# Altium project HYDRA_V3_POWER.PrjPcb (part 2 of 2)

## Sheet STM32G473CET6_PINOUT.SchDoc
size C; SheetNumber: 8; SheetTotal: 11
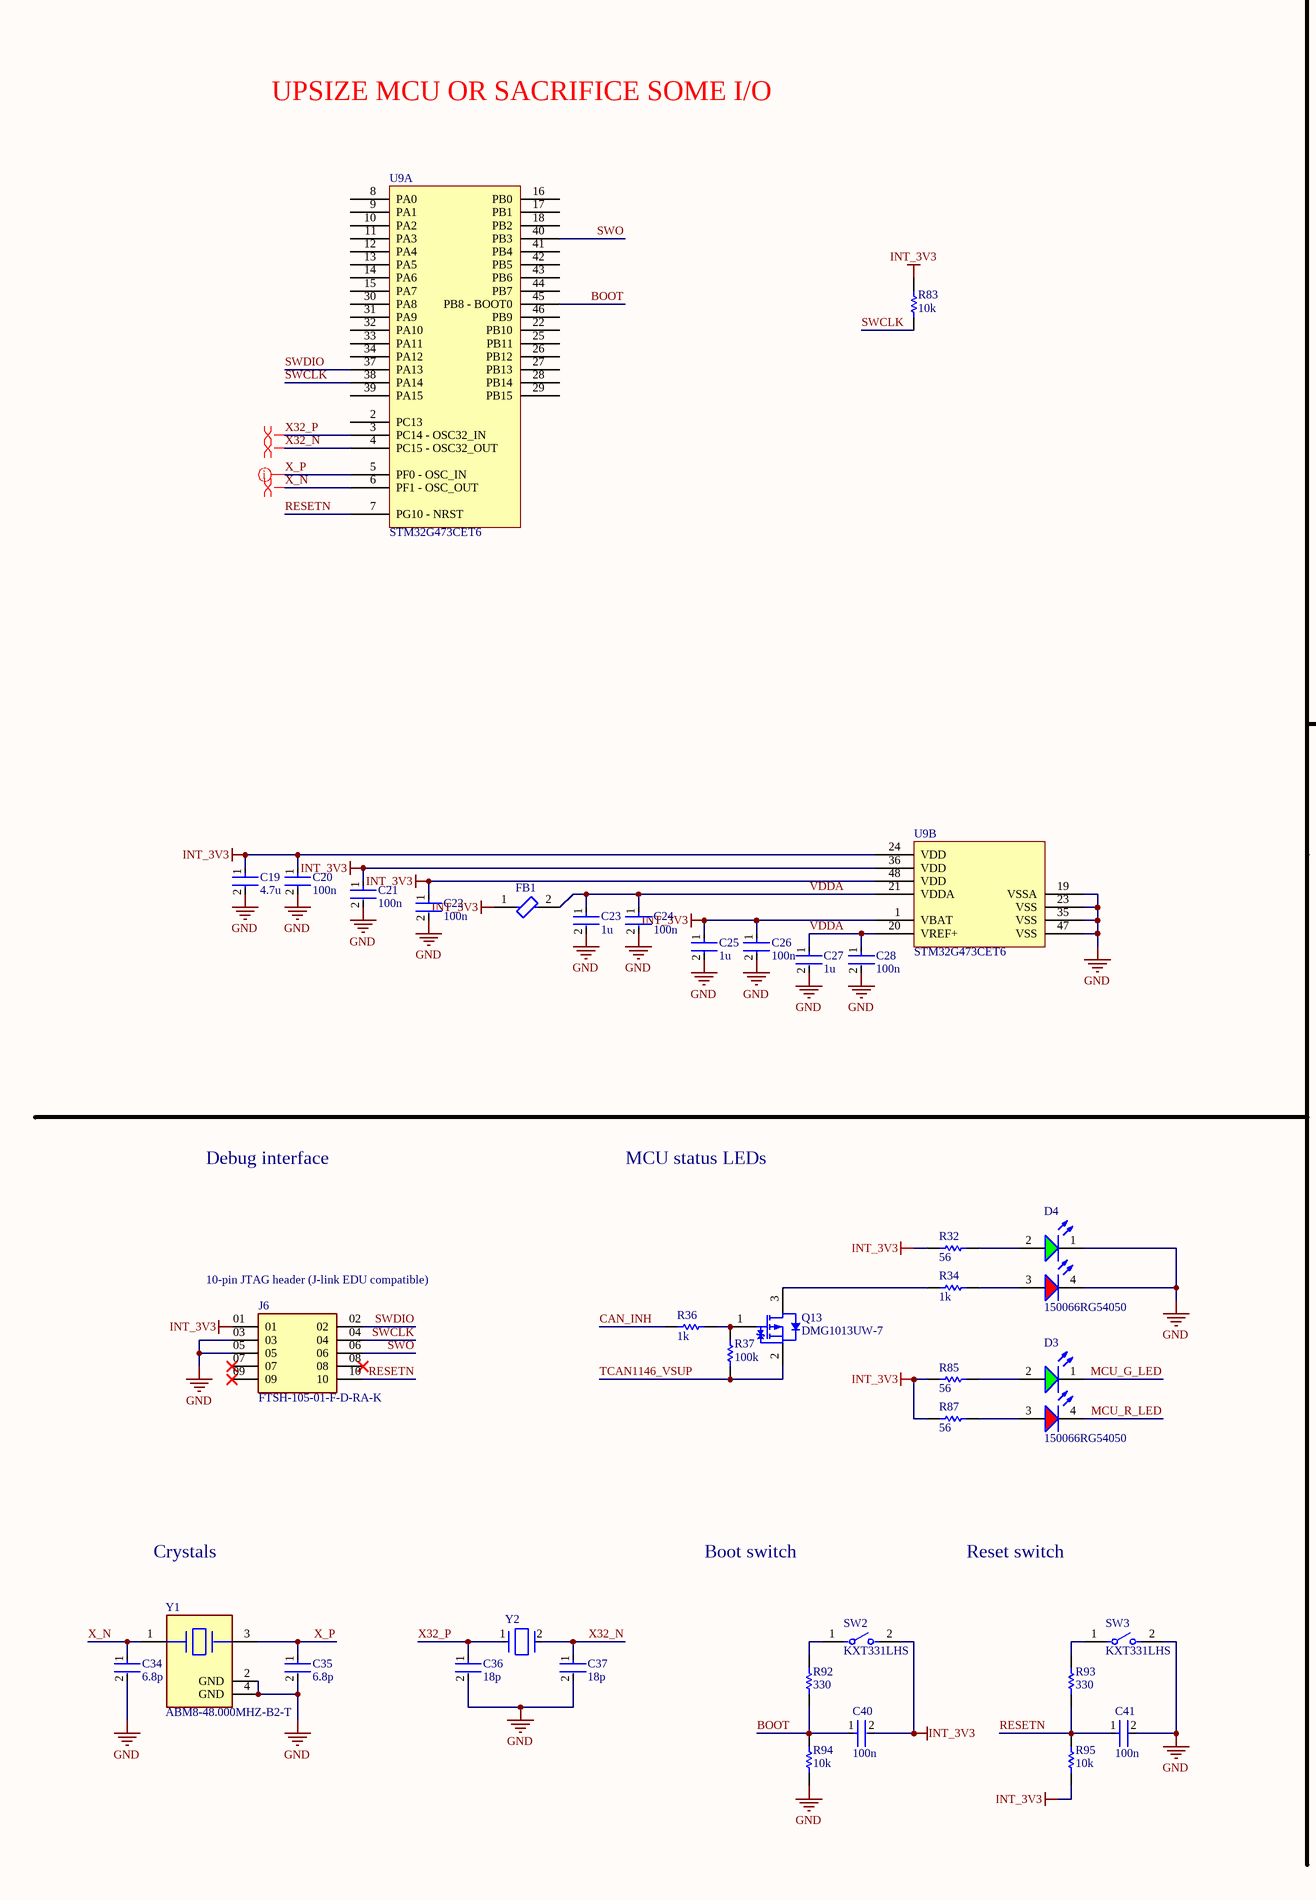
[diagram p12: STM32G473CET6_PINOUT.SchDoc, left]
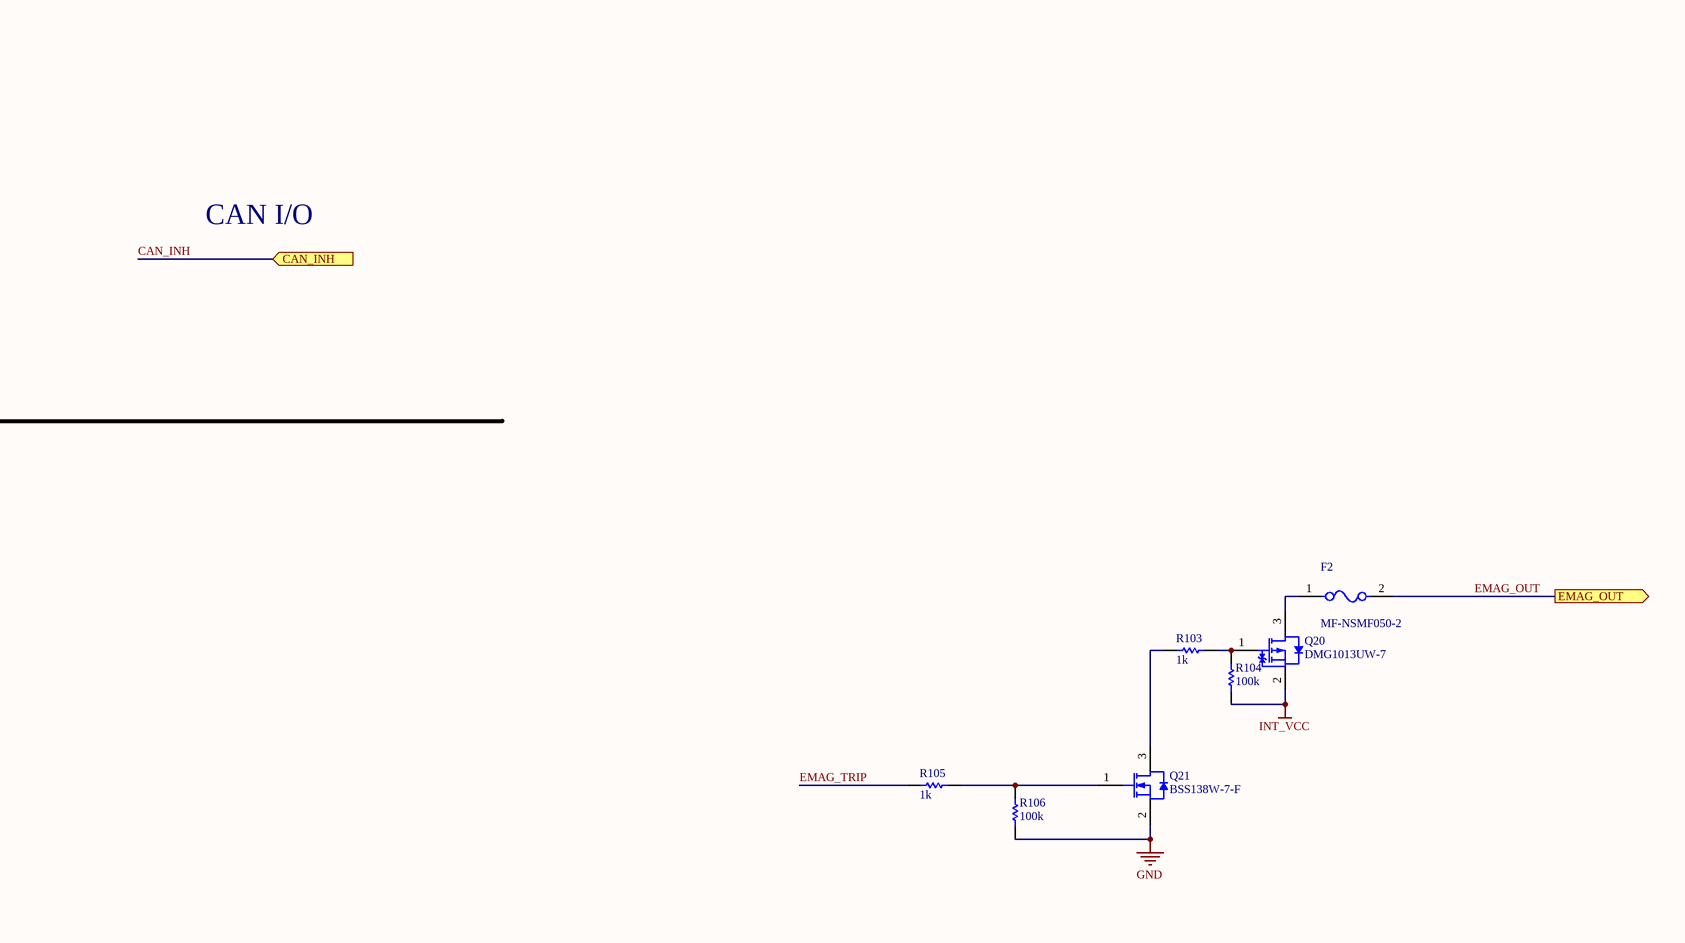
[diagram p13: STM32G473CET6_PINOUT.SchDoc, right]

### Parts
(Parts that share a designator on the sheet are numbered #1, #2 ... from top to bottom, then left to right.)
C19  4.7u  [FP-0402-L_1_0_0_05-W_0_5-IPC_A]
C20  100n  [FP-0402-L_1_0_0_05-W_0_5-IPC_A]
C21  100n  [FP-0402-L_1_0_0_05-W_0_5-IPC_A]
C22  100n  [FP-0402-L_1_0_0_05-W_0_5-IPC_A]
C23  1u  [FP-0402-L_1_0_0_05-W_0_5-IPC_A]
C24  100n  [FP-0402-L_1_0_0_05-W_0_5-IPC_A]
C25  1u  [FP-0402-L_1_0_0_05-W_0_5-IPC_A]
C26  100n  [FP-0402-L_1_0_0_05-W_0_5-IPC_A]
C27  1u  [FP-0402-L_1_0_0_05-W_0_5-IPC_A]
C28  100n  [FP-0402-L_1_0_0_05-W_0_5-IPC_A]
C34  6.8p  [FP-0402-L_1_0_0_05-W_0_5-IPC_A]
C35  6.8p  [FP-0402-L_1_0_0_05-W_0_5-IPC_A]
C36  18p  [FP-0402-L_1_0_0_05-W_0_5-IPC_A]
C37  18p  [FP-0402-L_1_0_0_05-W_0_5-IPC_A]
C40  100n  [FP-0402-L_1_0_0_05-W_0_5-IPC_A]
C41  100n  [FP-0402-L_1_0_0_05-W_0_5-IPC_A]
D3  150066RG54050  [WL-SBCD_0606]
D4  150066RG54050  [WL-SBCD_0606]
F2#2  MF-NSMF050-2  [FP-MF-NSMF050-2-MFG]
FB1  BLM15PX601SN1D  [FP-BLM15-0_05-MFG]  (value not drawn)
J6  FTSH-105-01-F-D-RA-K  [FTSH-105-01-F-D-RA-K-Footprint-1]
Q13  DMG1013UW-7  [DIOD-SOT323-3_V]
Q20  DMG1013UW-7  [DIOD-SOT323-3_V]
Q21  BSS138W-7-F  [DIOD-SOT323-3_V]
R32  56  [R0603B]
R34  1k  [R0603B]
R36  1k  [R0603B]
R37  100k  [R0603B]
R83  10k  [R0603B]
R85  56  [R0603B]
R87  56  [R0603B]
R92  330  [R0603B]
R93  330  [R0603B]
R94  10k  [R0603B]
R95  10k  [R0603B]
R103  1k  [R0603B]
R104  100k  [R0603B]
R105  1k  [R0603B]
R106  100k  [R0603B]
SW2  KXT331LHS  [FP-KXT331LHS-MFG]
SW3  KXT331LHS  [FP-KXT331LHS-MFG]
U9  STM32G473CET6  [TSQFP50P900X900X160-48N]  (parts A,B of 2)
Y1  ABM8-48.000MHZ-B2-T  [FP-ABM8-MFG]
Y2  ECS-.327-12.5-1210-TR  [FP-ECX-1210-MFG]  (value not drawn)

### Ports
CAN_INH (in), EMAG_OUT (out)

### Nets
GND: C19.2 C20.2 C21.2 C22.2 C23.2 C24.2 C25.2 C26.2 C27.2 C28.2 C34.2 C35.2 C36.2 C37.2 C41.2 D4.1(K) D4.4(K) J6.03 J6.05 Q21.2(S) R94.1 R106.1 SW3.2 U9.19(VSSA) U9.23(VSS) U9.35(VSS) U9.47(VSS) Y1.2(GND) Y1.4(GND)
INT_3V3: C19.1 C20.1 C21.1 C22.1 C25.1 C26.1 C40.2 FB1.1 J6.01 R32.2 R83.2 R85.2 R87.2 R95.1 SW2.2 U9.1(VBAT) U9.24(VDD) U9.36(VDD) U9.48(VDD)
INT_VCC: Q20.2(S) R104.2  [project net INT_PWR]
BOOT: C40.1 R92.1 R94.2 U9.45(PB8_-_BOOT0)
CAN_INH: R36.2 ; port CAN_INH
EMAG_OUT: F2#2.2 ; port EMAG_OUT
EMAG_TRIP: R105.2
MCU_G_LED: D3.1(K)
MCU_R_LED: D3.4(K)
RESETN: C41.1 J6.10 R93.1 R95.2 U9.7(PG10_-_NRST)
SWCLK: J6.04 R83.1 U9.38(PA14)
SWDIO: J6.02 U9.37(PA13)
SWO: J6.06 U9.40(PB3)
TCAN1146_VSUP: Q13.2(S) R37.2
VDDA: C23.1 C24.1 C27.1 C28.1 FB1.2 U9.20(VREF+) U9.21(VDDA)
X32_N: C37.1 U9.4(PC15_-_OSC32_OUT) Y2.2(Out/In)
X32_P: C36.1 U9.3(PC14_-_OSC32_IN) Y2.1(In/Out)
X_N: C34.1 U9.6(PF1_-_OSC_OUT) Y1.1
X_P: C35.1 U9.5(PF0_-_OSC_IN) Y1.3
NetD3_2: D3.2(A) R85.1
NetD3_3: D3.3(A) R87.1
NetD4_2: D4.2(A) R32.1
NetD4_3: D4.3(A) R34.1
NetF2#2_1: F2#2.1 Q20.3(D)
NetQ13_1: Q13.1(G) R36.1 R37.1
NetQ13_3: Q13.3(D) R34.2
NetQ20_1: Q20.1(G) R103.1 R104.1
NetQ21_1: Q21.1(G) R105.1 R106.2
NetQ21_3: Q21.3(D) R103.2
NetR92_2: R92.2 SW2.1
NetR93_2: R93.2 SW3.1

Not connected (* = marked no-connect by the designer): J6 07* 08* 09*; U9 2(PC13) 8(PA0) 9(PA1) 10(PA2) 11(PA3) 12(PA4) 13(PA5) 14(PA6) 15(PA7) 16(PB0) 17(PB1) 18(PB2) 22(PB10) 25(PB11) 26(PB12) 27(PB13) 28(PB14) 29(PB15) 30(PA8) 31(PA9) 32(PA10) 33(PA11) 34(PA12) 39(PA15) 41(PB4) 42(PB5) 43(PB6) 44(PB7) 46(PB9)

### Layout directives
differential pair: X32_N, X32_P, X_N, X_P

### Notes on the sheet
- UPSIZE MCU OR SACRIFICE SOME I/O
- CAN I/O
- Debug interface
- MCU status LEDs
- (near J6) 10-pin JTAG header (J-link EDU compatible)
- Crystals
- Boot switch
- Reset switch

### Library data of the parts
C19-C28 C34-C37 C40 C41 = CMP-001-00058-1: LARGE PADS, 0402 CAP, CHANGE COMMENT TO MATCH REAL P/N; Capacitor Type: Ceramic; Min Operating Temperature: -55°C; Mounting Technology: Surface Mount; Pins: 2; Case/Package: 0402; RoHS Compliant: Yes; Max Operating Temperature: 85°C
D3 D4 = CMP-004-00040-2: Led, Red/Grn, 180Mcd/230Mcd, 624Nm/525Nm Rohs Compliant: Yes; Source: rgled.SchLib; Component Type: Standard; Design Item ID: CMP-004-00034-2; Pins: 4
F2#2 = CMP-07400-000036-1: PTC RESET FUSE 13.2V 500MA 1206; Manufacturer: Bourns; Resistance: 0.15-0.7Ω; Hold Current: 0.5A; Trip Current: 1A; Current Rating: 100A; Value: 0.15-0.7Ω; Automotive Grade: Grade 3; Trip Time: 0.1s; Temperature Range Low: -40°C; Temperature: -40°C to +85°C; Digikey Description: PTC RESET FUSE 13.2V 500MA 1206; Ambient Temperature Range Low: -40°C; RoHS: TRUE; Device Class L2: PTC Resettable Fuses; Octopart: https://octopart.com/mf-nsmf050-2-bourns-34532; ComponentLink2Description: Datasheet; Voltage Rating: 13.2V; Category: Fuse; ComponentLink2URL: https://www.bourns.com/docs/product-datasheets/mfnsmf.pdf?sfvrsn=39c76af6_14; Mouser Description: Resettable Fuses - PPTC 0.50A 13.2V 0.15ohm 1206 Footprint; Temperature Range High: +85°C; Device Class L1: Circuit Protection; Device Class L3: unset; Automotive: Yes; Package: MF-NSMF050-2; Ambient Temperature Range High: +85°C; Height: 0.85mm; Manufacturer Part Number: MF-NSMF050-2; Lead Free: Yes
FB1 = CMP-0686-00252-4: Chip Ferrite Bead, 0402, 600Ω @ 100MHz, 0.23Ω, 25%, 900mA; Number of Circuits: 1; Impedance: 600R; DC Resistance (DCR): 230mR; Material: Steel; Length: 1mm; Package Quantity: 10000; Height: 0.5mm; Width: 0.5mm; Max DC Current: 900mA; Number of Lines: 1; Termination: SMD/SMT; Packaging: Tape and Reel; Lead Free: Lead Free; Min Operating Temperature: -55°C; Max Operating Temperature: 125°C; Max Current Rating: 900mA; Case Code (Imperial): 0402; Number of Pins: 2; Current Rating: 900mA; Test Frequency: 100MHz; Case/Package: 0402; Tolerance: 25%; Case Code (Metric): 1005
J6 = CMP-002-00041-5: Board Connector, 10 Contact(s), 2 Row(s), Male, Right Angle, 0.05 inch Pitch, Surface Mount Terminal, Locking, Black Insulator; Connector Type: BOARD CONNECTOR; Mounting Technology: Board; RoHS Compliant: Yes
Q13 Q20 = CMP-2000-06170-1: P-Channel Enhancement Mode MOSFET, 310 mW, 20 V, -55 to 150 degC, 3-Pin SOT-323, RoHS, Tape and Reel; Manufacturer: Diodes Inc; Qg Gate Charge: 0.622nC; Drain-Source On Resistance-Max: 750mO; Rated Power Dissipation: 310mW; Drain-to-Source Voltage [Vdss]: 20V; Package Reference: SOT323; Datasheet Version: Rev. 3-2, 09/2013; Package Description: 3-Pin Small Outline Transistor, Body 2 x 1.25 mm, Pitch 0.65 mm; Mounting Technology: SurfaceMount; Manufacturer URL: http://www.diodes.com/; Datasheet URL: http://www.diodes.com/_files/datasheets/ds31861.pdf; Channel Type: P-Channel
Q21 = CMP-2000-05968-1: N-Channel Enhancement Mode Mosfet, 50 V, 200 mA, -55 to 150 degC, 6-Pin SOT-323, RoHS, Tape and Reel; Typical Turn-Off Delay Time: 20ns; Number of Channels: 1Channel; Type: EnhancementModeFieldEffectTransistor; Brand: DiodesIncorporated; Vds - Drain-Source Breakdown Voltage: 75V; Vgs - Gate-Source Voltage: 20V; Rds On - Drain-Source Resistance: 1.4Ohms; Transistor Type: 1N-Channel; Configuration: Single; Unit Weight: 0.000212oz; Pd - Power Dissipation: 200mW; Id - Continuous Drain Current: 200mA; Forward Transconductance - Min: 0.1S; Manufacturer URL: http://www.diodes.com/; Series: BSS138; Package Description: 3-Pin Small Outline Transistor, Body 2 x 1.25 mm, Pitch 0.65 mm; Mounting Technology: SurfaceMount; Product Category: MOSFET; RoHS: True; Maximum Operating Temperature: +150C; Height: 1mm; Length: 2.2mm; Technology: Si; Width: 1.35mm; Datasheet URL: http://www.diodes.com/_files/datasheets/ds30206.pdf; Manufacturer: DiodesIncorporated; Package / Case: SOT-323-3; Typical Turn-On Delay Time: 20ns; Transistor Polarity: N-Channel; Factory Pack Quantity: 3000; Packaging: Reel; Product: MOSFETSmallSignal; Datasheet Version: Rev. 11-2, 09/2013; Package Reference: SOT323; Minimum Operating Temperature: -55C; Mounting Style: SMD/SMT; Channel Mode: Enhancement
R32 R34 R36 R37 R83 R85 R87 R92-R95 R103-R106 = CMP-009-00002-14: Resistor
SW2 SW3 = CMP-10040-000029-1: SWITCH TACTILE SPST-NO 0.02A 15V; Operating Force: 240gf; Switch Travel: 0.13mm; Illumination Type: Non-Illuminated; Throw Configuration: SPST; Number of Ports: 1; Current Rating: 5A; Mechanical Life: 500000Cycles; Switch Function: Off-Mom; Connector Type: USB; Actuator Type: Standard; Gender: Receptacle; Number of Contacts: 24; Contact Plating: Gold; Insulation Color: Black; Min Operating Temperature: -40°C; Packaging: Tape and Reel; Flammability Rating: UL94 V-0; Max Operating Temperature: 85°C; Termination: Solder; Mount: Surface Mount
U9 = CMP-020-00018-2: RISC Microcontroller, 32-Bit, 170MHz; RoHS Compliant: Yes
Y1 = CMP-27762-011708-1: Crystal 48MHz ±20ppm 18pF SMD-4 3.2mm x 2.5mm; Series Resistance: 35R; Frequency Stability: 50ppm; Package Quantity: 1000; Packaging: Tape and Reel; Mount: Surface Mount; Length: 3.2mm; Load Capacitance: 18pF; Max Operating Temperature: 70°C; Operating Frequency: 48 MHz; RoHS Compliant: Yes; Series: ABM8; Frequency Tolerance: 20ppm; Lead Free: Lead Free; Min Operating Temperature: -20°C; Case/Package: CSMD; Number of Pins: 4; Height: 0.031inch; ESR (Equivalent Series Resistance): 35R; Frequency: 48MHz; Radiation Hardening: No; Width: 0.098inch; Tolerance: 20ppm; Termination: SMD/SMT; Depth: 2.5mm; Resistor Type: Ceramic; REACH SVHC: No SVHC
Y2 = CMP-40224-000006-1: CRYSTAL 32.7680KHZ 12.5PF SMD; Manufacturer: ECS International; Frequency: 32.768kHz; Esr: 90kΩ; Tolerance: 20ppm; Device Class L1: Passive Components; Load Capacitance: 12.5pF; Temperature: -40°C to +85°C; ComponentLink2URL: https://ecsxtal.com/store/pdf/ECX-1210.pdf; Series: ECX-1210; Octopart: https://octopart.com/ecs-.327-12.5-1210-tr-ecs+international-81221340; ComponentLink2Description: Datasheet; Temperature Range Low: -40°C; Digikey Description: CRYSTAL 32.7680KHZ 12.5PF SMD; Lead Free: Yes; RoHS: TRUE; Device Class L3: Crystals; Automotive: No; Category: Crys; Height: 0.5mm; Manufacturer Part Number: ECS-.327-12.5-1210-TR; Temperature Range High: +85°C; Device Class L2: Crystals / Oscillators; Package: ECX-1210

## Nets that join several sheets
GND: HYDRA_V4_POWER (50 pins), PWR_PROT (14 pins), CELL_SENSE (21 pins), MOSFET_JUNCTION (23 pins), INT_REG (9 pins), HYDRA_REGULATORS (28 pins), RP_AND_SAFETYSW (Q16.1 Q16.4 R57.2 R59.1), LS_0 (5 pins), LS_1 (5 pins), LS_2 (5 pins), STM32G473CET6_PINOUT (29 pins)
HYDRA_3V3: HYDRA_V4_POWER (8 pins), LS_2 (R97_LS_2.2 U13_LS_2.6)
HYDRA_5V: HYDRA_V4_POWER (8 pins), LS_1 (R97_LS_1.2 U13_LS_1.6)
HYDRA_VCC: HYDRA_V4_POWER (J1.01 J1.02 J4.01 J4.02), LS_0 (R97_LS_0.2 U13_LS_0.6)
INT_3V3: HYDRA_V4_POWER (Q14.2 R76.2 U8.5), PWR_PROT (C4.1 U4.12), CELL_SENSE (C51.1 C52.1 U14.1 U14.20), MOSFET_JUNCTION (C1.1 C2.1 U1.12 U2.12), INT_REG (C7.1 R38.2 U5.2), LS_0 (R102_LS_0.2), LS_1 (R102_LS_1.2), LS_2 (R102_LS_2.2), STM32G473CET6_PINOUT (19 pins)
INT_PWR: HYDRA_V4_POWER (F3.1 F4.2 F5.1 R67.2), MOSFET_JUNCTION (Q3.5-6-7-8), STM32G473CET6_PINOUT (Q20.2 R104.2)
CELL_0_IN: HYDRA_V4_POWER (J8.1), CELL_SENSE (R73.2)
CELL_1_IN: HYDRA_V4_POWER (J8.2), CELL_SENSE (R71.2)
CELL_2_IN: HYDRA_V4_POWER (J8.3), CELL_SENSE (R65.2)
CELL_3_IN: HYDRA_V4_POWER (J8.4), CELL_SENSE (R63.2)
HYDRA_3V3_PG: HYDRA_V4_POWER (U8.1), LS_2 (R102_LS_2.1 U13_LS_2.3)
HYDRA_5V_PG: HYDRA_V4_POWER (U8.6), LS_1 (R102_LS_1.1 U13_LS_1.3)
HYDRA_VCC_PG: HYDRA_V4_POWER (U8.3), LS_0 (R102_LS_0.1 U13_LS_0.3)
M1_INH: HYDRA_V4_POWER (R68.2), MOSFET_JUNCTION (R16.2)
M1_PWR: PWR_PROT (U4.1 U4.2), MOSFET_JUNCTION (Q5.5-6-7-8)
M2_I_nFAULT: HYDRA_V4_POWER (R75.2), PWR_PROT (U4.6), MOSFET_JUNCTION (U1.6 U2.6), HYDRA_REGULATORS (U6.4 U7.4)
M2_PWR: HYDRA_V4_POWER (F2#1.1), MOSFET_JUNCTION (R54.2 U1.3 U1.4)
M3_PWR: MOSFET_JUNCTION (U2.3 U2.4), HYDRA_REGULATORS (F7.1 F8.1)
NetC6_1: HYDRA_V4_POWER (F5.2), INT_REG (5 pins)
NetC8_1: HYDRA_REGULATORS (5 pins), LS_1 (R96_LS_1.2 U13_LS_1.5)
NetC13_1: HYDRA_REGULATORS (5 pins), LS_2 (R96_LS_2.2 U13_LS_2.5)
NetF1_2: HYDRA_V4_POWER (F1.2), RP_AND_SAFETYSW (Q19.5-6-7-8)
NetF3_2: HYDRA_V4_POWER (F3.2), LS_0 (R96_LS_0.2 U13_LS_0.5)
nINHIBIT: HYDRA_V4_POWER (J7.1), RP_AND_SAFETYSW (R62.2)
OC_PROT_PWR_IN: PWR_PROT (5 pins), RP_AND_SAFETYSW (Q18.5-6-7-8)